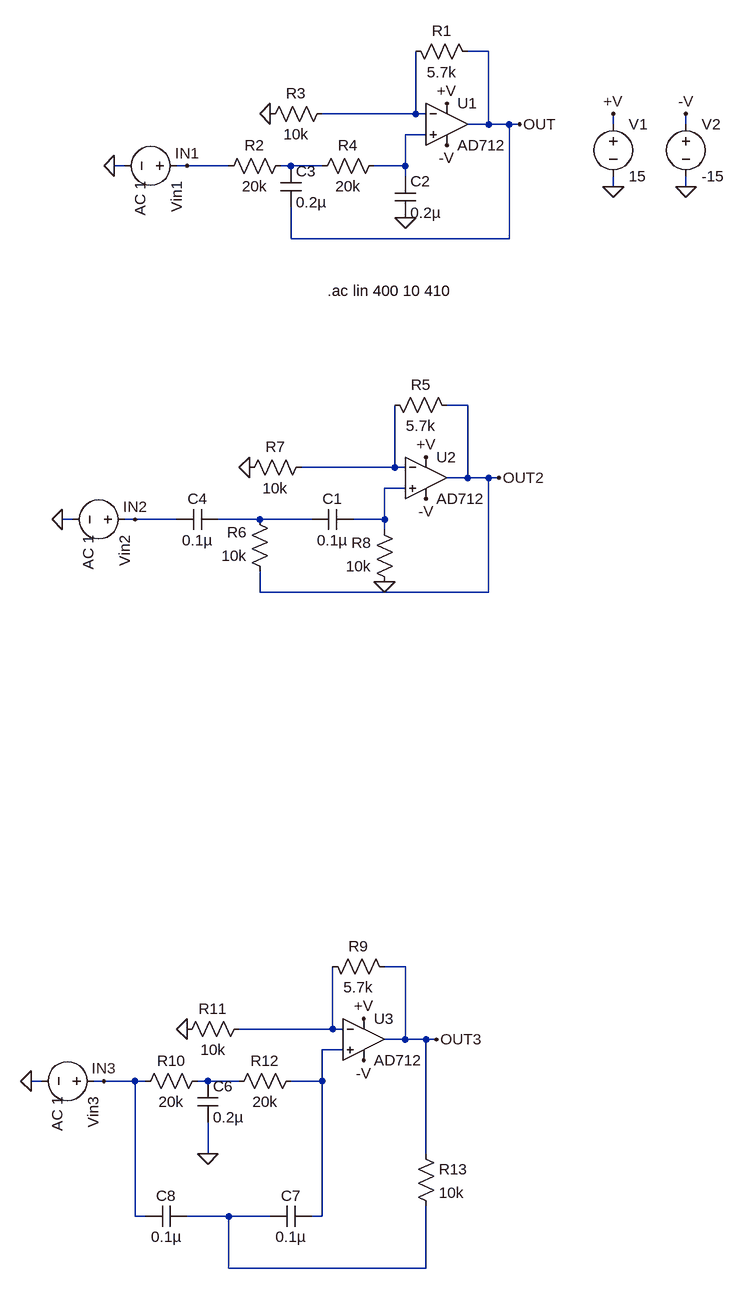
[diagram p0: schematic SourceWaveFit.asc]
SourceWaveFit.asc, the LTspice schematic file:
Version 4.1
SHEET 1 880 1876
WIRE 192 0 160 0
WIRE 80 96 80 0
WIRE 80 96 -64 96
WIRE 96 96 80 96
WIRE 192 112 192 0
WIRE 192 112 160 112
WIRE 224 112 192 112
WIRE 240 112 224 112
WIRE 384 112 384 96
WIRE 496 112 496 96
WIRE 96 128 64 128
WIRE -368 176 -384 176
WIRE -272 176 -288 176
WIRE -208 176 -272 176
WIRE -112 176 -128 176
WIRE -64 176 -112 176
WIRE 64 176 64 128
WIRE 64 176 16 176
WIRE 64 192 64 176
WIRE 384 208 384 192
WIRE 496 208 496 192
WIRE -112 288 -112 240
WIRE 224 288 224 112
WIRE 224 288 -112 288
WIRE 160 544 128 544
WIRE 48 640 48 544
WIRE 48 640 -96 640
WIRE 64 640 48 640
WIRE 160 656 160 544
WIRE 160 656 128 656
WIRE 192 656 160 656
WIRE 208 656 192 656
WIRE 64 672 32 672
WIRE -448 720 -464 720
WIRE -352 720 -368 720
WIRE -288 720 -352 720
WIRE -160 720 -224 720
WIRE -80 720 -160 720
WIRE 32 720 32 672
WIRE 32 720 -16 720
WIRE 32 736 32 720
WIRE -160 832 -160 800
WIRE 192 832 192 656
WIRE 192 832 -160 832
WIRE 64 1408 32 1408
WIRE -48 1504 -48 1408
WIRE -48 1504 -192 1504
WIRE -32 1504 -48 1504
WIRE 64 1520 64 1408
WIRE 64 1520 32 1520
WIRE 96 1520 64 1520
WIRE 112 1520 96 1520
WIRE -32 1536 -64 1536
WIRE -496 1584 -512 1584
WIRE -400 1584 -416 1584
WIRE -352 1584 -400 1584
WIRE -336 1584 -352 1584
WIRE -240 1584 -256 1584
WIRE -192 1584 -240 1584
WIRE -64 1584 -64 1536
WIRE -64 1584 -112 1584
WIRE -240 1696 -240 1648
WIRE 96 1696 96 1520
WIRE -352 1792 -352 1584
WIRE -336 1792 -352 1792
WIRE -208 1792 -272 1792
WIRE -144 1792 -208 1792
WIRE -64 1792 -64 1584
WIRE -64 1792 -80 1792
WIRE -208 1872 -208 1792
WIRE 96 1872 96 1776
WIRE 96 1872 -208 1872
FLAG -384 176 0
FLAG 240 112 OUT
FLAG -272 176 IN1
FLAG 128 80 +V
FLAG 128 144 -V
FLAG -144 96 0
FLAG 384 96 +V
FLAG 384 208 0
FLAG 496 96 -V
FLAG 496 208 0
FLAG 64 256 0
FLAG -464 720 0
FLAG 208 656 OUT2
FLAG -352 720 IN2
FLAG 96 624 +V
FLAG 96 688 -V
FLAG -176 640 0
FLAG 32 816 0
FLAG -512 1584 0
FLAG 112 1520 OUT3
FLAG -400 1584 IN3
FLAG 0 1488 +V
FLAG 0 1552 -V
FLAG -272 1504 0
FLAG -240 1696 0
SYMBOL voltage -272 176 R90
WINDOW 123 24 72 Left 2
WINDOW 39 24 125 Left 2
WINDOW 3 24 44 Left 2
SYMATTR Value2 AC 1
SYMATTR Value ""
SYMATTR InstName Vin1
SYMBOL AD712 128 48 R0
SYMATTR InstName U1
SYMBOL res 64 -16 M90
WINDOW 0 0 56 VBottom 2
WINDOW 3 32 56 VTop 2
SYMATTR InstName R1
SYMATTR Value 5.7k
SYMBOL res -112 160 R90
WINDOW 0 0 56 VBottom 2
WINDOW 3 32 56 VTop 2
SYMATTR InstName R2
SYMATTR Value 20k
SYMBOL res -48 80 R90
WINDOW 0 0 56 VBottom 2
WINDOW 3 32 56 VTop 2
SYMATTR InstName R3
SYMATTR Value 10k
SYMBOL voltage 384 96 R0
WINDOW 123 0 0 Left 2
WINDOW 39 0 0 Left 2
SYMATTR InstName V1
SYMATTR Value 15
SYMBOL voltage 496 96 R0
WINDOW 123 24 146 Left 2
WINDOW 39 24 125 Left 2
SYMATTR InstName V2
SYMATTR Value -15
SYMBOL res 32 160 R90
WINDOW 0 0 56 VBottom 2
WINDOW 3 32 56 VTop 2
SYMATTR InstName R4
SYMATTR Value 20k
SYMBOL cap 48 192 R0
SYMATTR InstName C2
SYMATTR Value 0.2µ
SYMBOL cap -128 176 R0
SYMATTR InstName C3
SYMATTR Value 0.2µ
SYMBOL voltage -352 720 R90
WINDOW 123 24 72 Left 2
WINDOW 39 24 125 Left 2
WINDOW 3 24 44 Left 2
SYMATTR Value2 AC 1
SYMATTR Value ""
SYMATTR InstName Vin2
SYMBOL AD712 96 592 R0
SYMATTR InstName U2
SYMBOL res 32 528 M90
WINDOW 0 0 56 VBottom 2
WINDOW 3 32 56 VTop 2
SYMATTR InstName R5
SYMATTR Value 5.7k
SYMBOL res -144 816 R180
WINDOW 0 36 76 Left 2
WINDOW 3 36 40 Left 2
SYMATTR InstName R6
SYMATTR Value 10k
SYMBOL res -80 624 R90
WINDOW 0 0 56 VBottom 2
WINDOW 3 32 56 VTop 2
SYMATTR InstName R7
SYMATTR Value 10k
SYMBOL res 48 832 R180
WINDOW 0 36 76 Left 2
WINDOW 3 36 40 Left 2
SYMATTR InstName R8
SYMATTR Value 10k
SYMBOL cap -16 704 R90
WINDOW 0 0 32 VBottom 2
WINDOW 3 32 32 VTop 2
SYMATTR InstName C1
SYMATTR Value 0.1µ
SYMBOL cap -224 704 R90
WINDOW 0 0 32 VBottom 2
WINDOW 3 32 32 VTop 2
SYMATTR InstName C4
SYMATTR Value 0.1µ
SYMBOL voltage -400 1584 R90
WINDOW 123 24 72 Left 2
WINDOW 39 24 125 Left 2
WINDOW 3 24 44 Left 2
SYMATTR Value2 AC 1
SYMATTR Value ""
SYMATTR InstName Vin3
SYMBOL AD712 0 1456 R0
SYMATTR InstName U3
SYMBOL res -64 1392 M90
WINDOW 0 0 56 VBottom 2
WINDOW 3 32 56 VTop 2
SYMATTR InstName R9
SYMATTR Value 5.7k
SYMBOL res -240 1568 R90
WINDOW 0 0 56 VBottom 2
WINDOW 3 32 56 VTop 2
SYMATTR InstName R10
SYMATTR Value 20k
SYMBOL res -176 1488 R90
WINDOW 0 0 56 VBottom 2
WINDOW 3 32 56 VTop 2
SYMATTR InstName R11
SYMATTR Value 10k
SYMBOL res -96 1568 R90
WINDOW 0 0 56 VBottom 2
WINDOW 3 32 56 VTop 2
SYMATTR InstName R12
SYMATTR Value 20k
SYMBOL cap -256 1584 R0
SYMATTR InstName C6
SYMATTR Value 0.2µ
SYMBOL cap -80 1776 R90
WINDOW 0 0 32 VBottom 2
WINDOW 3 32 32 VTop 2
SYMATTR InstName C7
SYMATTR Value 0.1µ
SYMBOL cap -272 1776 R90
WINDOW 0 0 32 VBottom 2
WINDOW 3 32 32 VTop 2
SYMATTR InstName C8
SYMATTR Value 0.1µ
SYMBOL res 80 1680 R0
SYMATTR InstName R13
SYMATTR Value 10k
TEXT -56 368 Left 2 !.ac lin 400 10 410

The netlist it stands for:
* SourceWaveFit.asc
Vin1 IN1 0 AC 1
* U1: AD712 (symbol AD712 not available, pins judged from their places): In+=N002 In-=N001 V+=+V V-=-V OUT=OUT
R1 N001 OUT 5.7k
R2 N003 IN1 20k
R3 N001 0 10k
V1 +V 0 15
V2 -V 0 -15
R4 N002 N003 20k
C2 N002 0 0.2µ
C3 N003 OUT 0.2µ
Vin2 IN2 0 AC 1
* U2: AD712 (symbol AD712 not available, pins judged from their places): In+=N005 In-=N004 V+=+V V-=-V OUT=OUT2
R5 N004 OUT2 5.7k
R6 OUT2 N006 10k
R7 N004 0 10k
R8 0 N005 10k
C1 N005 N006 0.1µ
C4 N006 IN2 0.1µ
Vin3 IN3 0 AC 1
* U3: AD712 (symbol AD712 not available, pins judged from their places): In+=N008 In-=N007 V+=+V V-=-V OUT=OUT3
R9 N007 OUT3 5.7k
R10 N009 IN3 20k
R11 N007 0 10k
R12 N008 N009 20k
C6 N009 0 0.2µ
C7 N008 N010 0.1µ
C8 N010 IN3 0.1µ
R13 OUT3 N010 10k
.ac lin 400 10 410
.backanno
.end